# EAGLE design pads (EAGLE 9.6.2)
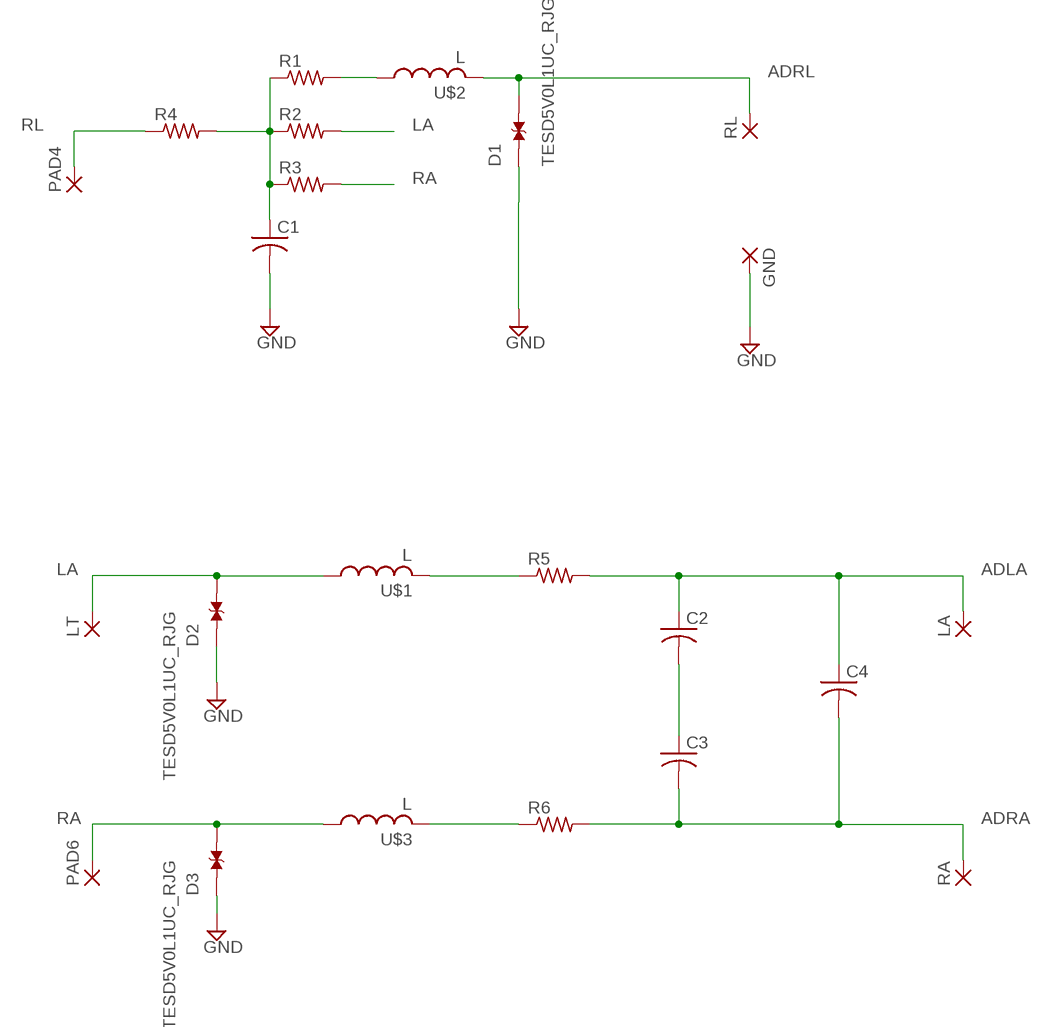
[diagram p0: schematic, sheet 1]

## Parts
C1  C-US025-024X044  [C025-024X044]
C2  C-US025-024X044  [C025-024X044]
C3  C-US025-024X044  [C025-024X044]
C4  C-US025-024X044  [C025-024X044]
D1  TESD5V0L1UC_RJG  [DIO_TESD5V0L1UC_RJG]
D2  TESD5V0L1UC_RJG  [DIO_TESD5V0L1UC_RJG]
D3  TESD5V0L1UC_RJG  [DIO_TESD5V0L1UC_RJG]
GND  2,15/1,0  [2,15/1,0]
LA  2,15/1,0  [2,15/1,0]
LT  SMD5  [SMD2,54-5,08]
PAD4  SMD5  [SMD2,54-5,08]
PAD6  SMD5  [SMD2,54-5,08]
R1  R-US_0207/10  [0207/10]
R2  R-US_0207/10  [0207/10]
R3  R-US_0207/10  [0207/10]
R4  R-US_0207/10  [0207/10]
R5  R-US_0207/10  [0207/10]
R6  R-US_0207/10  [0207/10]
RA  2,15/1,0  [2,15/1,0]
RL  2,15/1,0  [2,15/1,0]
U$1  L  [6000]
U$2  L  [6000]
U$3  L  [6000]

## Nets
ADLA: C2.1 C4.1 LA.1(P) R5.2
ADRA: C3.2 C4.2 R6.2 RA.1(P)
ADRL: D1.2 RL.1(P) U$2.2
GND: C1.2 D1.1 D2.1 D3.1 GND.1(P)
LA: D2.2 LT.1(P) R2.2 U$1.1
N$1: C1.1 R1.1 R2.1 R3.1 R4.2
N$3: R1.2 U$2.1
N$8: R5.1 U$1.2
N$10: C2.2 C3.1
N$12: R6.1 U$3.2
RA: D3.2 PAD6.1(P) R3.2 U$3.1
RL: PAD4.1(P) R4.1

## Library data of the parts
C1-C4 = adafruit:C-US: CAPACITOR, American symbol
D1-D3 = TESD5V0L1UC_RJG:TESD5V0L1UC_RJG: Check availability <https://pricing.snapeda.com/parts/TESD5V0L1UC%20RJG/Taiwan%20Semiconductor%20Corporation/view-part?ref=eda>; AVAILABILITY: In Stock; DESCRIPTION: DFN1006L, 5V, 100W, 2pF, ESD Protection Diode & Array; MF: Taiwan Semiconductor Corporation; MP: TESD5V0L1UC RJG; PACKAGE: DFN1006L Taiwan Semiconductor; PRICE: None; PURCHASE-URL: https://pricing.snapeda.com/search/part/TESD5V0L1UC RJG/?ref=eda
GND LA RA RL = wirepad:2,15/1,0: THROUGH-HOLE PAD
LT PAD4 PAD6 = wirepad:SMD5: SMD PAD
R1-R6 = adafruit:R-US_: RESISTOR, American symbol
U$1-U$3 = adafruit:L

## Net classes
0 default: clearance 0.762 mm

## Board
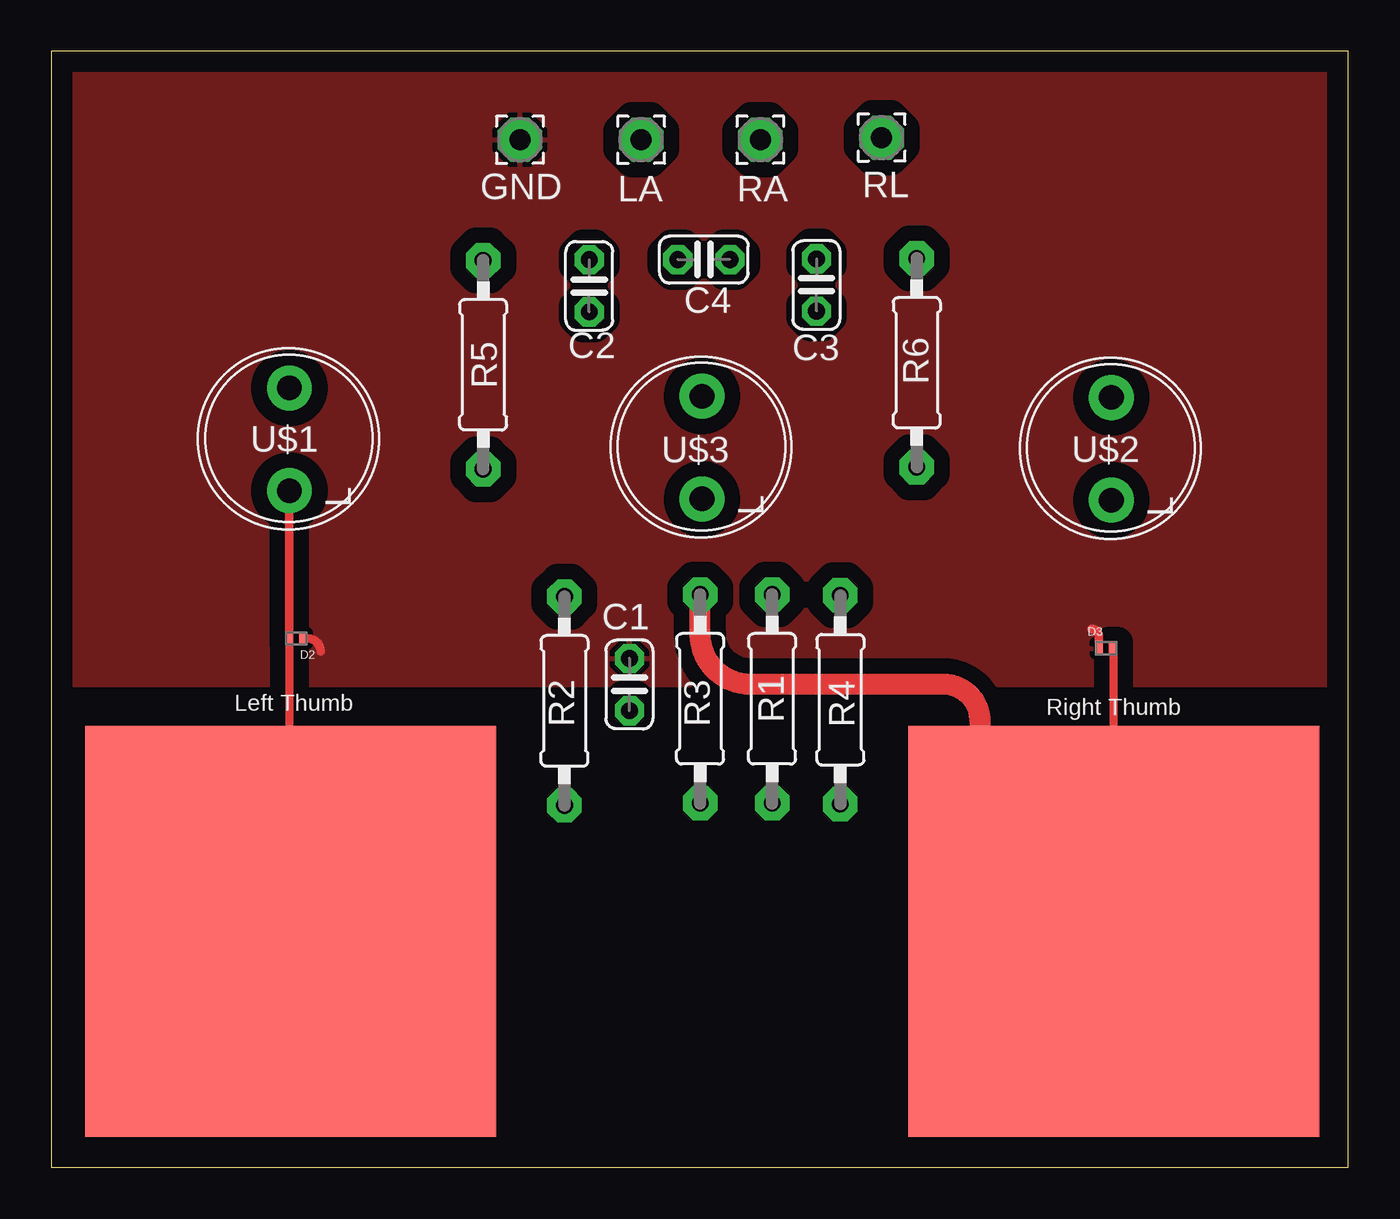
[diagram p1: board, top side]
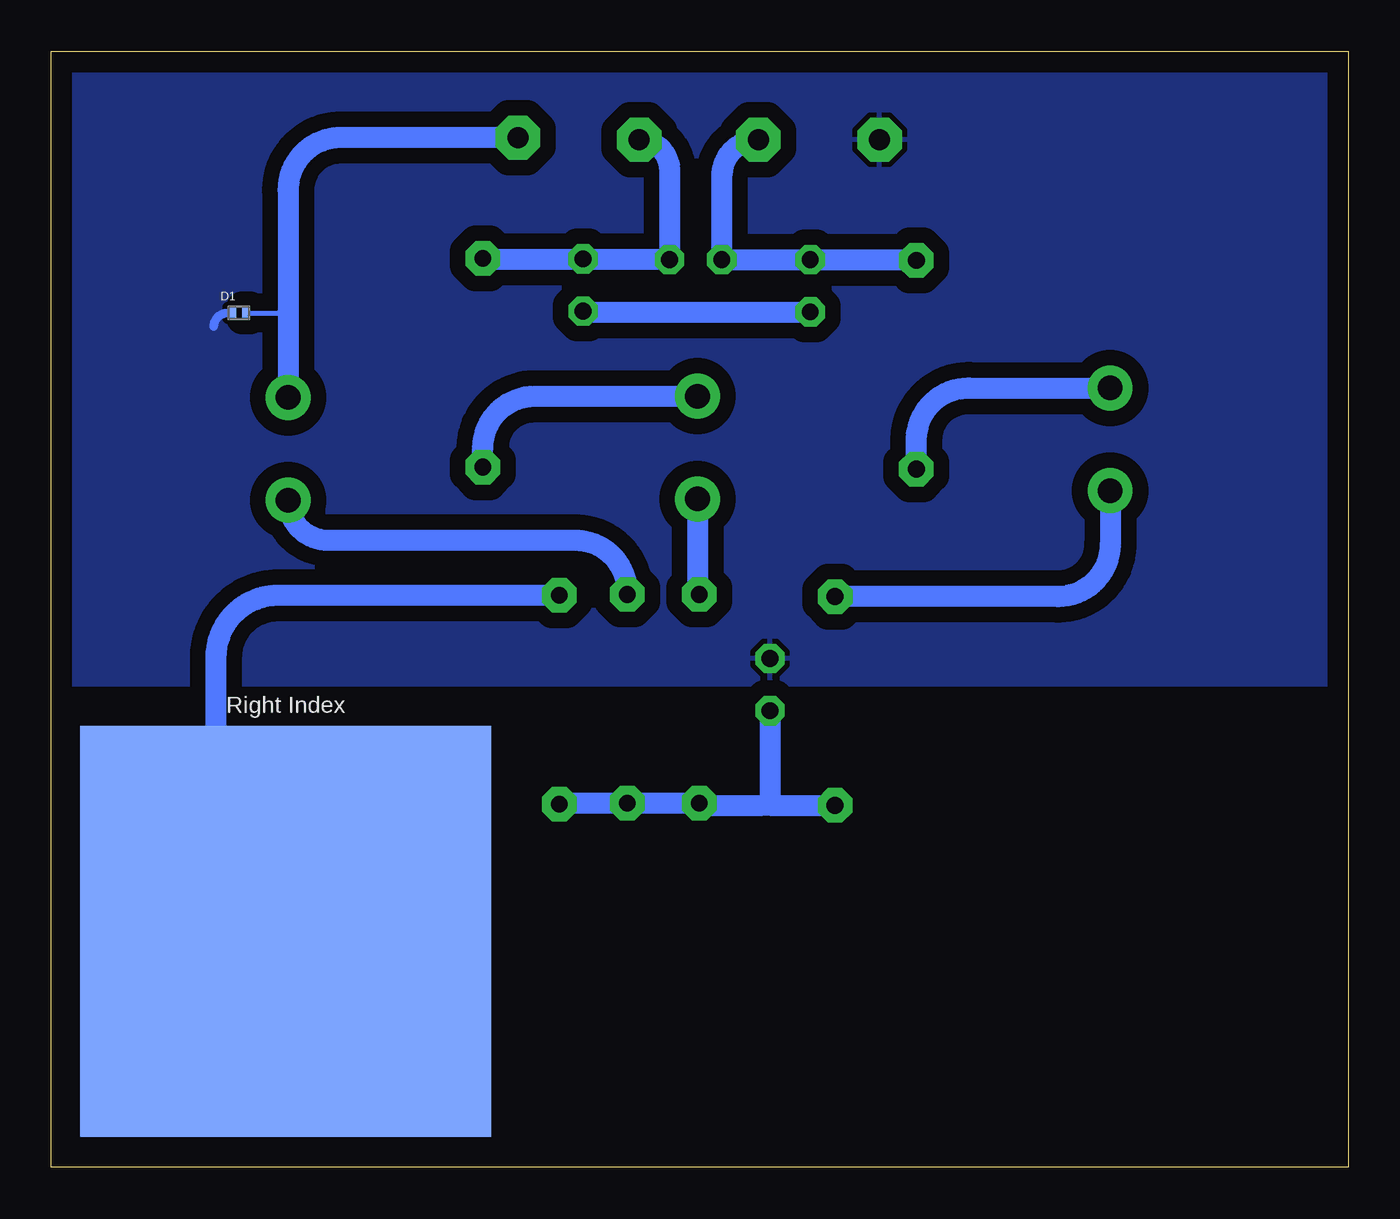
[diagram p2: board, bottom side, seen from below]

Size 63.1 x 54.3 mm. Coordinates in mm from the lower left corner, seen from the top.
Outline: 0,0 63.1,0 63.1,54.3 0,54.3 0,0
Copper layers (1*16): Top 0.035mm / dielectric 1.5mm / Bottom 0.035mm
Design rules "default *": minimum track width 6mil, minimum drill 0.35mm, track to track 10mil, track to pad 10mil, pad to pad 10mil, via to via 10mil, smd to smd 10mil, copper to edge 40mil, drill to drill 6mil, minimum pad ring 10mil, minimum via ring 8mil, stop-mask expansion 4mil, vias tented up to drill 0mil, thermal gap 10mil

### Footprints (pad centres in the part's own frame; a part is rotated, then mirrored left to right if it is on the bottom)
C025-024X044 = drill 0.813 pad 1.422 octagon: 1 -1.27,0; 2 1.27,0
DIO_TESD5V0L1UC_RJG = smd 0.41 x 0.56: 1 -0.35,0; 2 0.35,0
2,15/1,0 = drill 1.016 pad 2.159 octagon: 1 0,0
SMD2,54-5,08 = smd 20 x 20: 1 0,0
0207/10 = drill 0.813 pad 1.676 octagon: 1 -5.08,0; 2 5.08,0
6000 = drill 1.2 pad 2.184: 1 -2.5,0; 2 2.5,0

### Placement (x,y rotation side)
C1  28.13,23.49 90 top
C2  26.17,42.89 270 top
C3  37.23,42.93 90 top
C4  31.75,44.17 0 top
D1  53.97,41.57 0 bottom
D2  11.92,25.73 180 top
D3  51.32,25.25 0 top
GND  22.8,50 0 top
LA  28.7,50 0 top
LT  11.64,11.48 0 top
PAD4  51.7,11.48 0 bottom
PAD6  51.7,11.48 0 top
R1  35.07,22.79 90 top
R2  24.97,22.69 90 top
R3  31.57,22.79 90 top
R4  38.39,22.75 270 top
R5  21.01,39.05 90 top
R6  42.11,39.15 90 top
RA  34.5,50 0 top
RL  40.4,50.1 0 top
U$1  11.58,35.42 90 top
U$2  51.58,34.96 90 top
U$3  31.66,35.02 90 top

### Tracks (layer width: path | path; a pad name or v marks a point on that pad's centre or on a via)
ADLA
  Bottom 1.016: R5.2 arc-90 21.04,44.16 C2.1 arc-90 C2.1 C4.1 30.48,48.22 arc90 LA.1
ADRA
  Bottom 1.016: R6.2 arc-90 42.08,44.2 C3.2 arc-90 37.2,44.17 C4.2 33.02,48.52 arc-90 RA.1
ADRL
  Bottom 0.254: D1.2 51.58,41.57 51.58,41.6
  Bottom 1.016: RL.1 49.04,50.1 arc-90 51.58,47.56 51.58,41.6 U$2.2
GND
  Top 0.406: D2.1 12.47,25.73 arc-90 13.1,25.1 | D3.1 50.97,25.83 arc90 50.6,26.2
  Bottom 0.406: D1.1 54.53,41.57 arc-90 55.2,40.9
  pour Top: 0.3,54.1 0.3,23.5 62.9,23.5 62.9,54.1
  pour Bottom: 0.1,54.2 0.1,23.5 63,23.5 63,54.2 0.2,54.2
LA
  Top 0.381: D2.2 11.57,11.55 arc90 LT.1
  Top 0.406: D2.2 U$1.1
  Bottom 1.016: U$1.1 11.58,30.31 arc90 14.12,27.77 R2.2
N$1
  Bottom 1.016: R4.2 arc90 38.35,17.71 R1.1 R3.1 arc-90 31.47,17.61 28.5,17.61 28.13,17.61 | 28.13,17.61 R2.1 | C1.1 28.13,17.61
N$3
  Bottom 1.016: R1.2 35.07,27.96 arc-90 37.61,30.5 49.62,30.5 arc90 U$2.1
N$8
  Bottom 1.016: R5.1 21.01,35.38 arc90 18.47,37.92 U$1.2
N$10
  Bottom 1.016: C3.1 arc-90 37.19,41.62 C2.2
N$12
  Bottom 1.016: R6.1 42.11,34.98 arc90 39.57,37.52 U$3.2
RA
  Top 0.381: D3.2 51.67,11.51 arc90 PAD6.1
  Top 1.016: PAD6.1 47.74,11.48 arc-90 45.2,14.02 45.2,21.7 arc90 43.4,23.5 34,23.5 arc-90 31.57,25.93 R3.2
  Bottom 1.016: U$3.1 31.66,27.96 arc-90 R3.2
RL
  Bottom 1.016: R4.1 52.06,27.83 arc-90 55.1,24.79 55.1,11.48 PAD4.1

### Text on the board
tNames: Left Thumb | Right Thumb
bNames: Right Index